# Altium schematic sheet SunS_Decoupler.SchDoc: SunS separator
size A4; Author: Grzegorz Gajoch; DocumentNumber: 4; SheetNumber: 4; SheetTotal: 16; Model: EM1; PageSetup: Record=PageOptions|CenterHorizontal=True|CenterVertical=True|PrintScale=0.52|XCorrection=1.00|YCorrection=1.00|PrintKind=1|BorderSize=5000000|LeftOffset=0|BottomOffset=0|Orientation=2|PaperLength=4200|PaperWidth=2970|Scale=100|PaperSource=7|PrintQuality=600|MediaType=1|DitherType=10|PaperKind=A3|PrintScaleMode=1
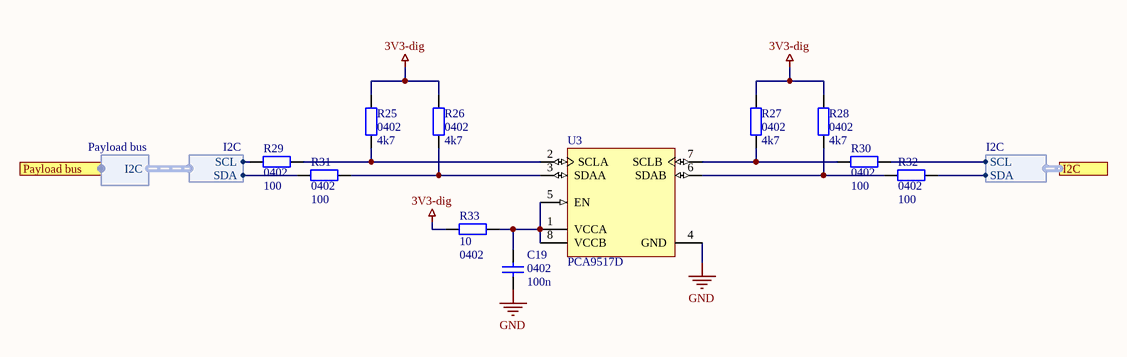
[diagram p0: SunS_Decoupler.SchDoc]

## Parts
C19  0402  value 100n  [SMD_Capacitor_0402]
R25  0402  value 4k7  [SMD_Resistor_0402]
R26  0402  value 4k7  [SMD_Resistor_0402]
R27  0402  value 4k7  [SMD_Resistor_0402]
R28  0402  value 4k7  [SMD_Resistor_0402]
R29  0402  value 100  [SMD_Resistor_0402]
R30  0402  value 100  [SMD_Resistor_0402]
R31  0402  value 100  [SMD_Resistor_0402]
R32  0402  value 100  [SMD_Resistor_0402]
R33  0402  value 10  [SMD_Resistor_0402]
U3  PCA9517D  [D8_N]

## Ports
I2C (harness I2C), Payload bus (harness Payload bus)

## Harnesses
I2C: SCL, SDA
Payload bus: I2C

## Nets
3V3-dig: R25.2 R26.2 R27.2 R28.2 R33.2
GND: C19.1 U3.4(GND)
NetC19_2: C19.2 R33.1 U3.1(VCCA) U3.5(EN) U3.8(VCCB)
NetR25_1: R25.1 R29.1 U3.2(SCLA)
NetR26_1: R26.1 R31.1 U3.3(SDAA)
NetR27_1: R27.1 R30.2 U3.7(SCLB)
NetR28_1: R28.1 R32.2 U3.6(SDAB)
NetR29_2: R29.2 ; harness I2C.SCL
NetR30_1: R30.1 ; port I2C.SCL
NetR31_2: R31.2 ; harness I2C.SDA
NetR32_1: R32.1 ; port I2C.SDA

## Notes on the sheet
- Title:
- Sheet:
- of
- Author:
- Model:
- Document Number:
- Checked by:
- Iss-Rev:
- Approved by:
- Date:
- File name:

## Library data of the parts
C19 = Cap1: Capacitor; Published: 8-Jun-2000; LatestRevisionDate: 17-Jul-2002; LatestRevisionNote: Re-released for DXP Platform.; PackageReference: RAD-0.3; Publisher: Altium Limited; PackageDescription: Radial Cap, Thru-Hole; 2 Leads; 0.3 in Pin Spacing
R25-R33 = Res2: Resistor; Published: 8-Jun-2000; LatestRevisionDate: 17-Jul-2002; LatestRevisionNote: Re-released for DXP Platform.; PackageReference: AXIAL-0.4; Publisher: Altium Limited; PackageDescription: Axial Device, Thru-Hole; 2 Leads; 0.4 in Pin Spacing
U3 = PCA9517D: Level-Translating I2C Bus Repeater, 2 Channel Width, 0.9 to 5.5 V, -40 to 85 degC, 8-pin SOIC (D), Green (RoHS & no Sb/Br); Manufacturer: Texas Instruments; SubFamily: I2C Hub, Buffer, Repeater; VCC(Max)(V): 5.5; VCC(Min)(V): 0.9; Technology Family: PCA; Max Frequency(kHz): 400; Channel Width: 2; 5V Tolerant I/O: Yes; DatasheetVersion: SCPS157D; PackageVersion: revM, Jun-2011; PackageReference: D8; PackageDescription: 8-Pin Plastic Small Outline Integrated Circuit, 4.9 x 3.9 mm, Pitch 1.27 mm Pitch; Supplier 1: Digi-Key; Supplier Part Number 1: PCA9517DTI-ND; Supplier 2: Farnell; Supplier Part Number 2: 1703190; Supplier 3: Newark; Supplier Part Number 3: 71M0457; Supplier 4: Mouser; Supplier Part Number 4: 595-PCA9517D; Eco-Plan: Green (RoHS & no Sb/Br); Vcc range(V): 0.9 to 5.5; Master Side I2C Bus Capacitance Supported(pF): 400; Slave Side I2C Bus Capacitance Supported(pF): 400; Open Drain I/O Type: Yes; Enable Pin: Yes; Mounting Technology: Surface Mount; PartNumber: PCA9517D; Code_JEDEC: MS-012AA; ComponentLink1Description: Datasheet; ComponentLink1URL: http://www.ti.com/general/docs/lit/getliterature.tsp?genericPartNumber=PCA9517&fileType=pdf